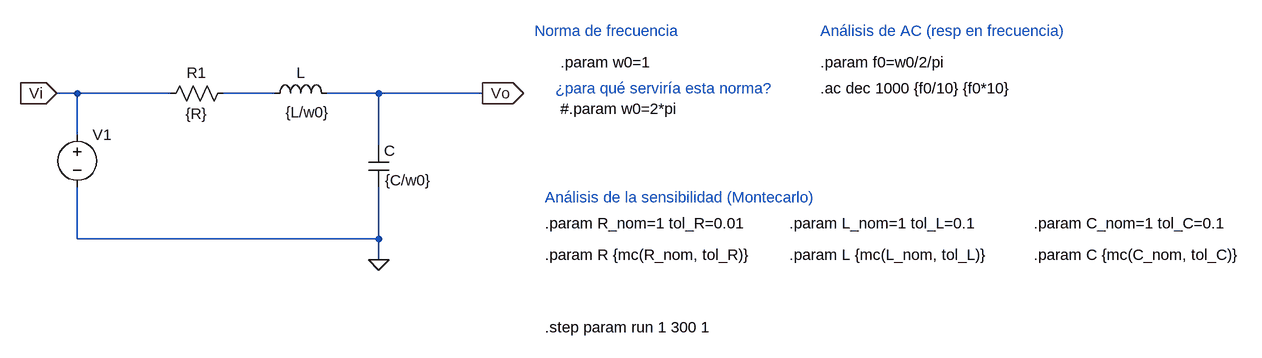
[diagram p0: schematic SOS RLC LP sensibilidad montecarlo.asc]
SOS RLC LP sensibilidad montecarlo.asc, the LTspice schematic file:
Version 4
SHEET 1 1472 872
WIRE -352 496 -384 496
WIRE -208 496 -352 496
WIRE -48 496 -128 496
WIRE 112 496 32 496
WIRE 272 496 112 496
WIRE -352 560 -352 496
WIRE 112 576 112 496
WIRE -352 720 -352 640
WIRE 112 720 112 640
WIRE 112 720 -352 720
WIRE 112 752 112 720
FLAG -384 496 Vi
IOPIN -384 496 In
FLAG 272 496 Vo
IOPIN 272 496 Out
FLAG 112 752 0
SYMBOL ind -64 512 R270
WINDOW 0 32 56 VTop 2
WINDOW 3 -29 66 VTop 2
SYMATTR InstName L
SYMATTR Value {L/w0}
SYMBOL cap 96 576 R0
WINDOW 3 26 54 Left 2
SYMATTR Value {C/w0}
SYMATTR InstName C
SYMBOL voltage -352 544 R0
WINDOW 3 24 96 Invisible 2
WINDOW 39 0 0 Left 0
SYMATTR Value SINE(0 1 0 0 0 0 1000)
SYMATTR InstName V1
SYMATTR Value2 AC 1 0
SYMBOL res -112 480 R90
WINDOW 0 0 56 VBottom 2
WINDOW 3 32 56 VTop 2
SYMATTR InstName R1
SYMATTR Value {R}
TEXT 744 696 Left 2 !.param L_nom=1 tol_L=0.1
TEXT 744 744 Left 2 !.param L {mc(L_nom, tol_L)}
TEXT 368 856 Left 2 !.step param run 1 300 1
TEXT 792 488 Left 2 !.ac dec 1000 {f0/10} {f0*10}
TEXT 792 448 Left 2 !.param f0=w0/2/pi
TEXT 392 520 Left 2 !#.param w0=2*pi
TEXT 392 448 Left 2 !.param w0=1
TEXT 352 400 Left 2 ;Norma de frecuencia
TEXT 384 488 Left 2 ;¿para qué serviría esta norma?
TEXT 792 400 Left 2 ;Análisis de AC (resp en frecuencia)
TEXT 368 656 Left 2 ;Análisis de la sensibilidad (Montecarlo)
TEXT 1120 696 Left 2 !.param C_nom=1 tol_C=0.1
TEXT 368 696 Left 2 !.param R_nom=1 tol_R=0.01
TEXT 1120 744 Left 2 !.param C {mc(C_nom, tol_C)}
TEXT 368 744 Left 2 !.param R {mc(R_nom, tol_R)}

The netlist it stands for:
* SOS RLC LP sensibilidad montecarlo.asc
L N001 Vo {L/w0}
C Vo 0 {C/w0}
V1 Vi 0 SINE(0 1 0 0 0 0 1000) AC 1 0
R1 N001 Vi {R}
.param L_nom=1 tol_L=0.1
.param L {mc(L_nom, tol_L)}
.step param run 1 300 1
.ac dec 1000 {f0/10} {f0*10}
.param f0=w0/2/pi
#.param w0=2*pi
.param w0=1
* Norma de frecuencia
* ¿para qué serviría esta norma?
* Análisis de AC (resp en frecuencia)
* Análisis de la sensibilidad (Montecarlo)
.param C_nom=1 tol_C=0.1
.param R_nom=1 tol_R=0.01
.param C {mc(C_nom, tol_C)}
.param R {mc(R_nom, tol_R)}
.backanno
.end